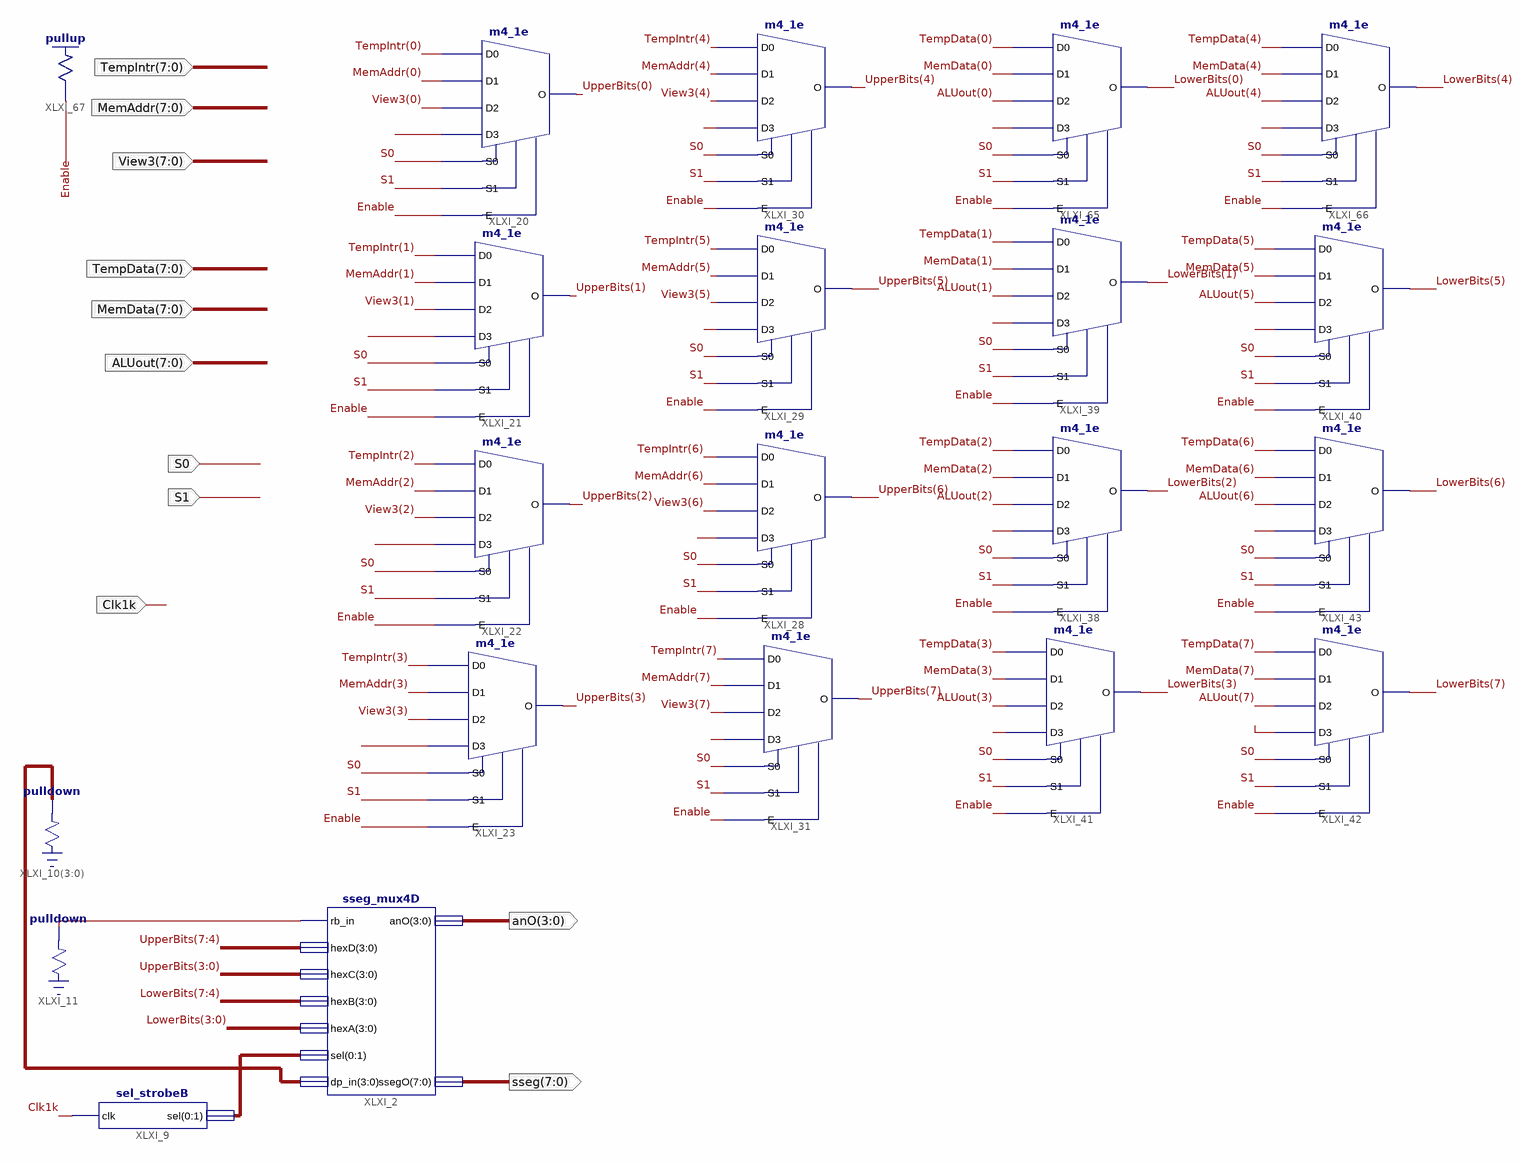
[diagram p0: schematic sheet 1]
// Xilinx ISE schematic DisplayModule.sch (spartan3e) as structural Verilog: 21 symbols, 11 ports
module DisplayModule (
  input  Clk1k,
  input  [7:0] TempIntr,
  input  [7:0] MemAddr,
  input  [7:0] View3,
  input  [7:0] TempData,
  input  [7:0] MemData,
  input  [7:0] ALUout,
  input  S0,
  input  S1,
  output [3:0] anO,
  output [7:0] sseg
);

  wire Enable, XLXN_36, XLXN_49, XLXN_153, XLXN_181, XLXN_188, XLXN_195, XLXN_202, XLXN_287, XLXN_291,
       XLXN_295, XLXN_299, XLXN_303, XLXN_307, XLXN_311, XLXN_315, XLXN_319, XLXN_327;
  wire [1:0] XLXN_34;
  wire [3:0] XLXN_35;
  wire [7:0] LowerBits, UpperBits;

  m4_1e XLXI_20 (
    .D0(TempIntr[0]), .D1(MemAddr[0]), .D2(View3[0]), .D3(XLXN_49), .E(Enable), .S0(S0), .S1(S1),
    .O(UpperBits[0]));
  m4_1e XLXI_21 (
    .D0(TempIntr[1]), .D1(MemAddr[1]), .D2(View3[1]), .D3(XLXN_287), .E(Enable), .S0(S0), .S1(S1),
    .O(UpperBits[1]));
  m4_1e XLXI_22 (
    .D0(TempIntr[2]), .D1(MemAddr[2]), .D2(View3[2]), .D3(XLXN_291), .E(Enable), .S0(S0), .S1(S1),
    .O(UpperBits[2]));
  m4_1e XLXI_23 (
    .D0(TempIntr[3]), .D1(MemAddr[3]), .D2(View3[3]), .D3(XLXN_295), .E(Enable), .S0(S0), .S1(S1),
    .O(UpperBits[3]));
  \pulldown  XLXI_10[3:0] (.O(XLXN_35));
  \pulldown  XLXI_11 (.O(XLXN_36));
  sel_strobeB XLXI_9 (.clk(Clk1k), .sel({XLXN_34[0], XLXN_34[1]}));
  sseg_mux4D XLXI_2 (
    .rb_in(XLXN_36), .hexD(UpperBits[7:4]), .hexC(UpperBits[3:0]), .hexB(LowerBits[7:4]),
    .hexA(LowerBits[3:0]), .sel({XLXN_34[0], XLXN_34[1]}), .dp_in(XLXN_35), .anO(anO), .ssegO(sseg));
  m4_1e XLXI_38 (
    .D0(TempData[2]), .D1(MemData[2]), .D2(ALUout[2]), .D3(XLXN_319), .E(Enable), .S0(S0), .S1(S1),
    .O(LowerBits[2]));
  m4_1e XLXI_41 (
    .D0(TempData[3]), .D1(MemData[3]), .D2(ALUout[3]), .D3(XLXN_315), .E(Enable), .S0(S0), .S1(S1),
    .O(LowerBits[3]));
  m4_1e XLXI_43 (
    .D0(TempData[6]), .D1(MemData[6]), .D2(ALUout[6]), .D3(XLXN_202), .E(Enable), .S0(S0), .S1(S1),
    .O(LowerBits[6]));
  m4_1e XLXI_40 (
    .D0(TempData[5]), .D1(MemData[5]), .D2(ALUout[5]), .D3(XLXN_181), .E(Enable), .S0(S0), .S1(S1),
    .O(LowerBits[5]));
  m4_1e XLXI_39 (
    .D0(TempData[1]), .D1(MemData[1]), .D2(ALUout[1]), .D3(XLXN_327), .E(Enable), .S0(S0), .S1(S1),
    .O(LowerBits[1]));
  m4_1e XLXI_65 (
    .D0(TempData[0]), .D1(MemData[0]), .D2(ALUout[0]), .D3(XLXN_153), .E(Enable), .S0(S0), .S1(S1),
    .O(LowerBits[0]));
  m4_1e XLXI_66 (
    .D0(TempData[4]), .D1(MemData[4]), .D2(ALUout[4]), .D3(XLXN_188), .E(Enable), .S0(S0), .S1(S1),
    .O(LowerBits[4]));
  m4_1e XLXI_31 (
    .D0(TempIntr[7]), .D1(MemAddr[7]), .D2(View3[7]), .D3(XLXN_311), .E(Enable), .S0(S0), .S1(S1),
    .O(UpperBits[7]));
  m4_1e XLXI_30 (
    .D0(TempIntr[4]), .D1(MemAddr[4]), .D2(View3[4]), .D3(XLXN_299), .E(Enable), .S0(S0), .S1(S1),
    .O(UpperBits[4]));
  m4_1e XLXI_29 (
    .D0(TempIntr[5]), .D1(MemAddr[5]), .D2(View3[5]), .D3(XLXN_303), .E(Enable), .S0(S0), .S1(S1),
    .O(UpperBits[5]));
  m4_1e XLXI_28 (
    .D0(TempIntr[6]), .D1(MemAddr[6]), .D2(View3[6]), .D3(XLXN_307), .E(Enable), .S0(S0), .S1(S1),
    .O(UpperBits[6]));
  \pullup  XLXI_67 (.O(Enable));
  m4_1e XLXI_42 (
    .D0(TempData[7]), .D1(MemData[7]), .D2(ALUout[7]), .D3(XLXN_195), .E(Enable), .S0(S0), .S1(S1),
    .O(LowerBits[7]));
endmodule
